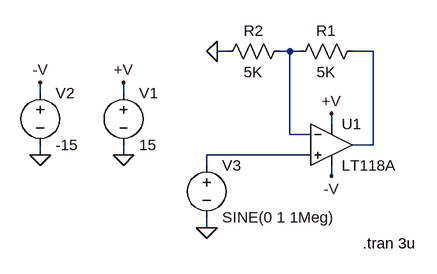
[diagram p0: schematic 118A.asc]
118A.asc, the LTspice schematic file:
Version 4
SHEET 1 896 680
WIRE 32 96 16 96
WIRE 128 96 112 96
WIRE 144 96 128 96
WIRE 256 96 224 96
WIRE -256 160 -256 144
WIRE -128 160 -128 144
WIRE 192 208 192 192
WIRE 128 224 128 96
WIRE 160 224 128 224
WIRE 256 240 256 96
WIRE 256 240 224 240
WIRE -256 256 -256 240
WIRE -128 256 -128 240
WIRE 160 256 0 256
WIRE 0 272 0 256
WIRE 192 288 192 272
WIRE 0 368 0 352
FLAG -128 256 0
FLAG 192 192 +V
FLAG -128 144 +V
FLAG 192 288 -V
FLAG -256 256 0
FLAG -256 144 -V
FLAG 16 96 0
FLAG 0 368 0
SYMBOL voltage -128 144 R0
SYMATTR InstName V1
SYMATTR Value 15
SYMBOL voltage -256 144 R0
SYMATTR InstName V2
SYMATTR Value -15
SYMBOL res 240 80 R90
WINDOW 0 0 56 VBottom 2
WINDOW 3 32 56 VTop 2
SYMATTR InstName R1
SYMATTR Value 5K
SYMBOL res 128 80 R90
WINDOW 0 0 56 VBottom 2
WINDOW 3 32 56 VTop 2
SYMATTR InstName R2
SYMATTR Value 5K
SYMBOL voltage 0 256 R0
SYMATTR InstName V3
SYMATTR Value SINE(0 1 1Meg)
SYMBOL opamps\\LT118A 192 240 R0
SYMATTR InstName U1
TEXT 240 392 Left 2 !.tran 3u

The netlist it stands for:
* 118A.asc
V1 +V 0 15
V2 -V 0 -15
R1 N002 N001 5K
R2 N001 0 5K
V3 N003 0 SINE(0 1 1Meg)
* U1: LT118A (symbol opamps\LT118A not available, pins judged from their places): In+=N003 In-=N001 V+=+V V-=-V OUT=N002
.tran 3u
.backanno
.end